# Altium project iMX6 Rex Development Baseboard V1I1.PrjPcb (part 1 of 2)
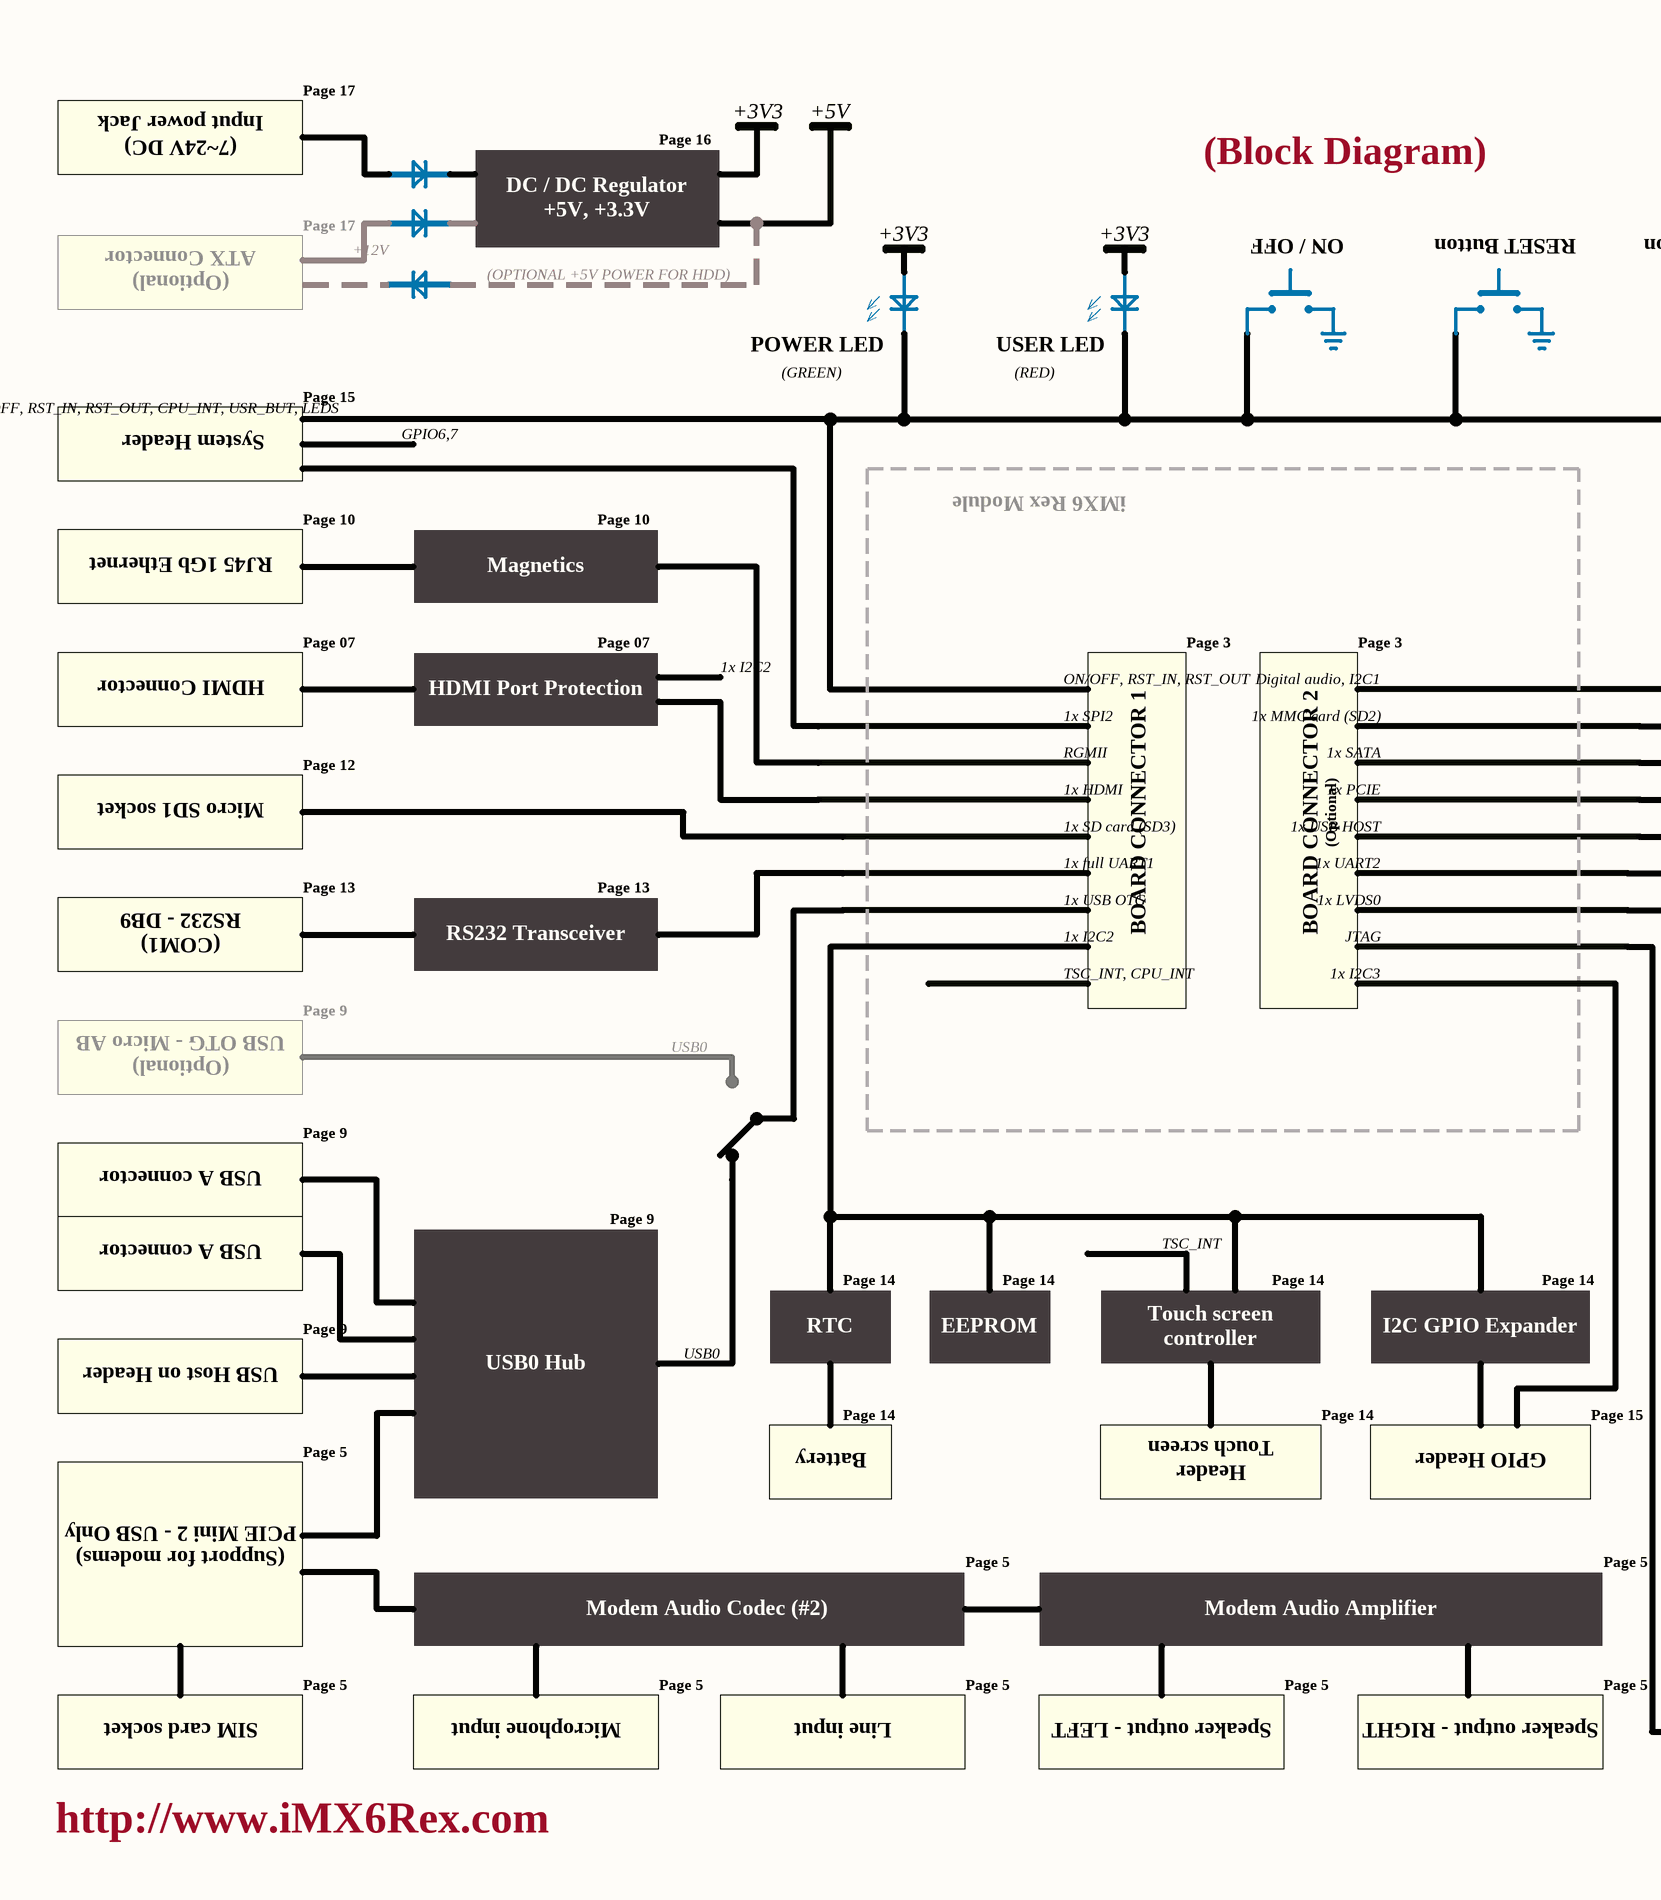
[diagram p0: [02] - BLOCK DIAGRAM.SchDoc, left]
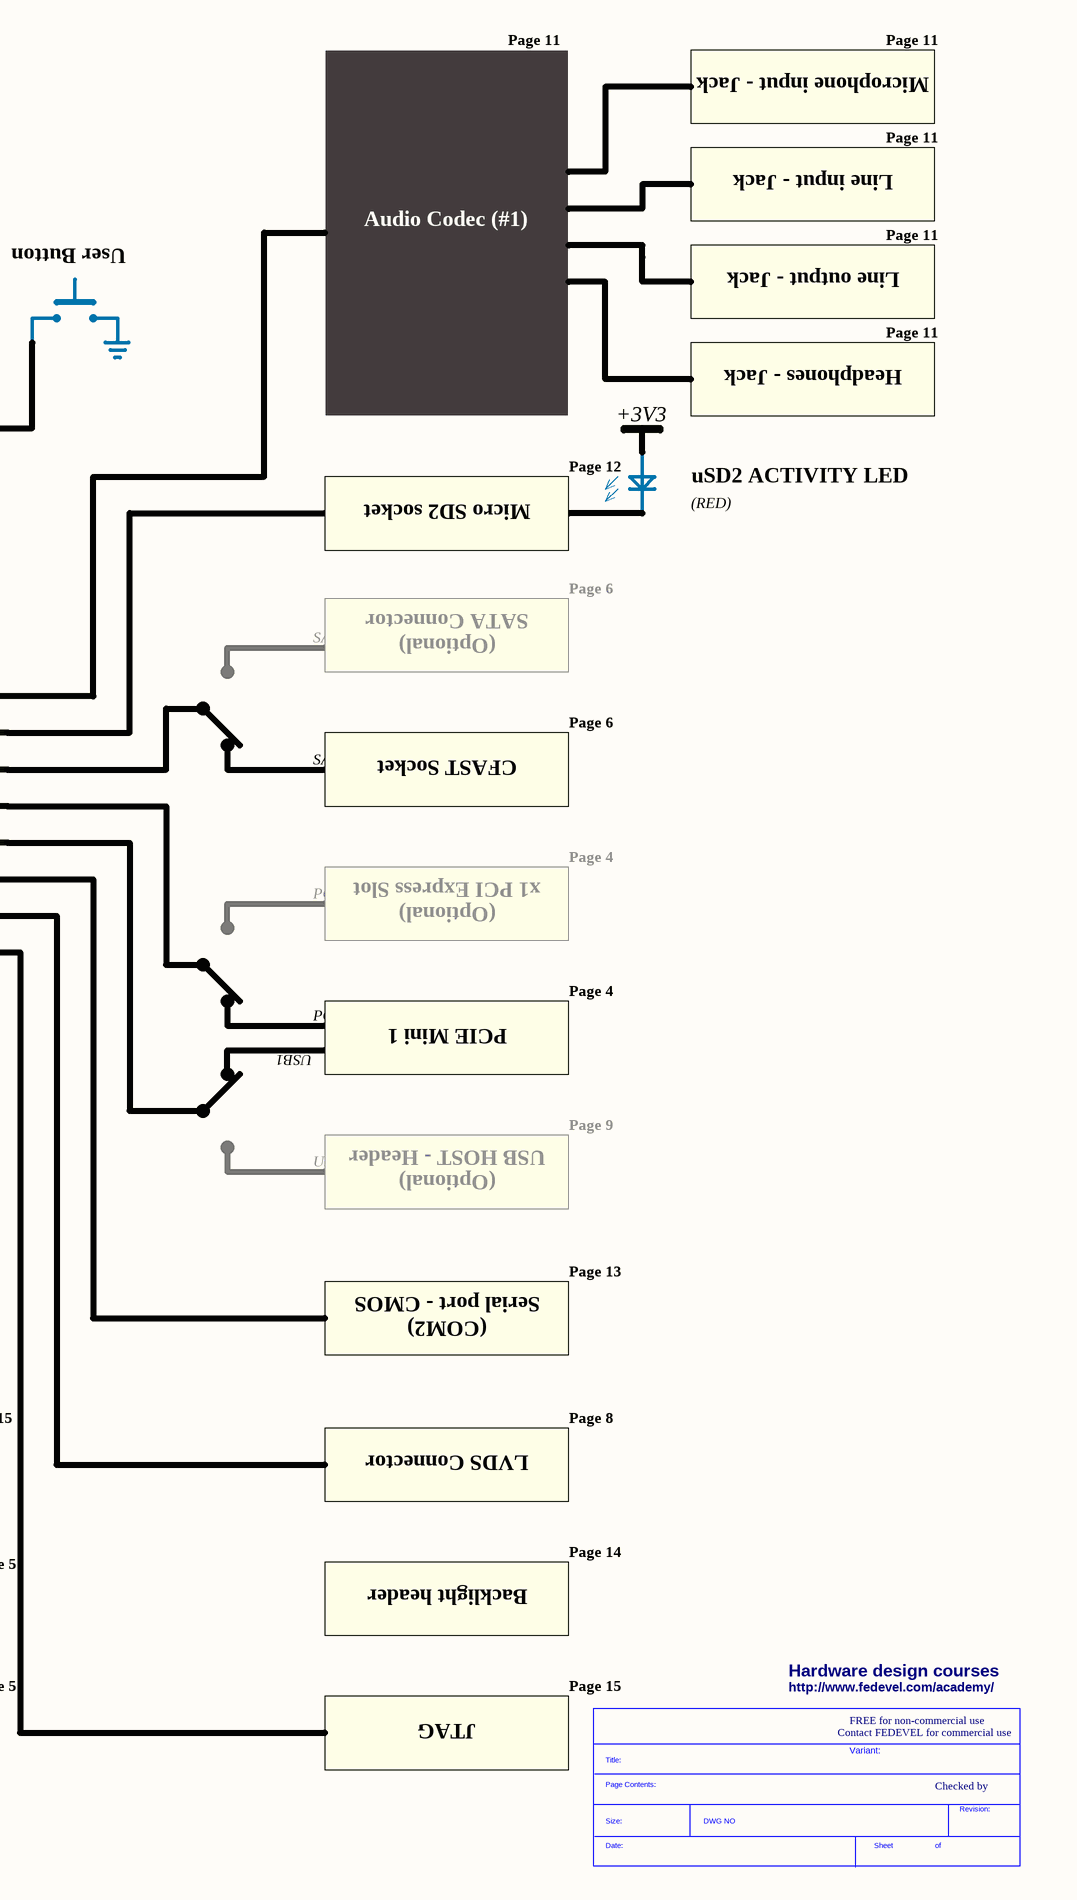
[diagram p1: [02] - BLOCK DIAGRAM.SchDoc, right]
ClientCompanyName: FEDEVEL Academy; ClientContactEmail: robert.feranec@fedevel.com; ClientContactName: Robert Feranec; ClientWebsite: http://www.fedevel.com/academy/; Company: (c) 2013 FEDEVEL www.fedevel.com; Project: iMX6 Rex Development Baseboard; VersionRevision: V1I1
4 sheets, 154 parts. Net scope: flat (ports and power ports of the same name join across sheets).
Board file: iMX6 Rex Development Baseboard V1I1_PCB.PcbDoc
Sheets:
  [02] - BLOCK DIAGRAM.SchDoc
  [05] - PCIE MINI 2, AUDIO2.SchDoc
  [08] - LVDS.SchDoc
  [13] - UARTS.SchDoc

## Sheet [02] - BLOCK DIAGRAM.SchDoc
size A2; DocumentNumber: 2; SheetNumber: 2; SheetTotal: 20; PageSetup: Record=PageOptions|CenterHorizontal=True|CenterVertical=True|PrintScale=0.73|XCorrection=1.00|YCorrection=1.00|PrintKind=0|BorderSize=5000000|LeftOffset=0|BottomOffset=0|Orientation=2|PaperLength=1000|PaperWidth=1000|Scale=100|PaperSource=7|PrintQuality=-4|MediaType=1|DitherType=10|PaperKind=A3|PrintScaleMode=1

### Parts
(Parts that share a designator on the sheet are numbered #1, #2 ... from top to bottom, then left to right.)
*#1  SDTitleBlock  (value not drawn)  (graphical)

### Notes on the sheet
- Page 11
- Microphone input - Jack
- Input power Jack
- Page 17
- Page 16
- +3V3
- +5V
- (7~24V DC)
- DC / DC Regulator
- (Block Diagram)
- Line input - Jack
- ATX Connector
- +12V
- +5V, +3.3V
- ON / OFF
- RESET Button
- User Button
- Audio Codec (#1)
- (Optional)
- (OPTIONAL +5V POWER FOR HDD)
- Line output - Jack
- (GREEN)
- POWER LED
- (RED)
- USER LED
- Headphones - Jack
- System Header
- Page 15
- ON/OFF, RST_IN, RST_OUT, CPU_INT, USR_BUT, LEDS
- GPIO6,7
- iMX6 Rex Module
- Micro SD2 socket
- Page 12
- uSD2 ACTIVITY LED
- RJ45 1Gb Ethernet
- Page 10
- Magnetics
- SATA
- SATA Connector
- Page 6
- HDMI Connector
- Page 07
- HDMI Port Protection
- 1x I2C2
- ON/OFF, RST_IN, RST_OUT
- Page 3
- Digital audio, I2C1
- RGMII
- 1x SPI2
- 1x SATA
- 1x MMC card (SD2)
- Micro SD1 socket
- 1x HDMI
- BOARD CONNECTOR 1
- BOARD CONNECTOR 2
- 1x PCIE
- CFAST Socket
- 1x SD card (SD3)
- 1x full UART1
- 1x USB HOST
- 1x UART2
- Page 4
- RS232 - DB9
- Page 13
- RS232 Transceiver
- 1x USB OTG
- JTAG
- 1x LVDS0
- PCIE
- x1 PCI Express Slot
- (COM1)
- TSC_INT, CPU_INT
- 1x I2C3
- USB OTG - Micro AB
- Page 9
- USB0
- USB1
- PCIE Mini 1
- USB A connector
- USB HOST - Header
- TSC_INT
- Page 14
- Serial port - CMOS
- USB0 Hub
- RTC
- EEPROM
- Touch screen
- controller
- I2C GPIO Expander
- (COM2)
- USB Host on Header
- Page 8
- Page 5
- Battery
- Header
- GPIO Header
- LVDS Connector
- PCIE Mini 2 - USB Only
- (Support for modems)
- Modem Audio Codec (#2)
- Modem Audio Amplifier
- Backlight header
- Hardware design courses
- SIM card socket
- Microphone input
- Line input
- Speaker output - LEFT
- Speaker output - RIGHT
- (near *#1) Page 15
- http://www.fedevel.com/academy/
- Contact FEDEVEL for commercial use
- FREE for non-commercial use
- Variant:
- Checked by
- http://www.iMX6Rex.com
- (in symbol SDTitleBlock) Title:; Page Contents:; Revision:; Size:; DWG NO; Date:; Sheet; of

## Sheet [05] - PCIE MINI 2, AUDIO2.SchDoc
size A2; DocumentNumber: 2; SheetNumber: 5; SheetTotal: 20
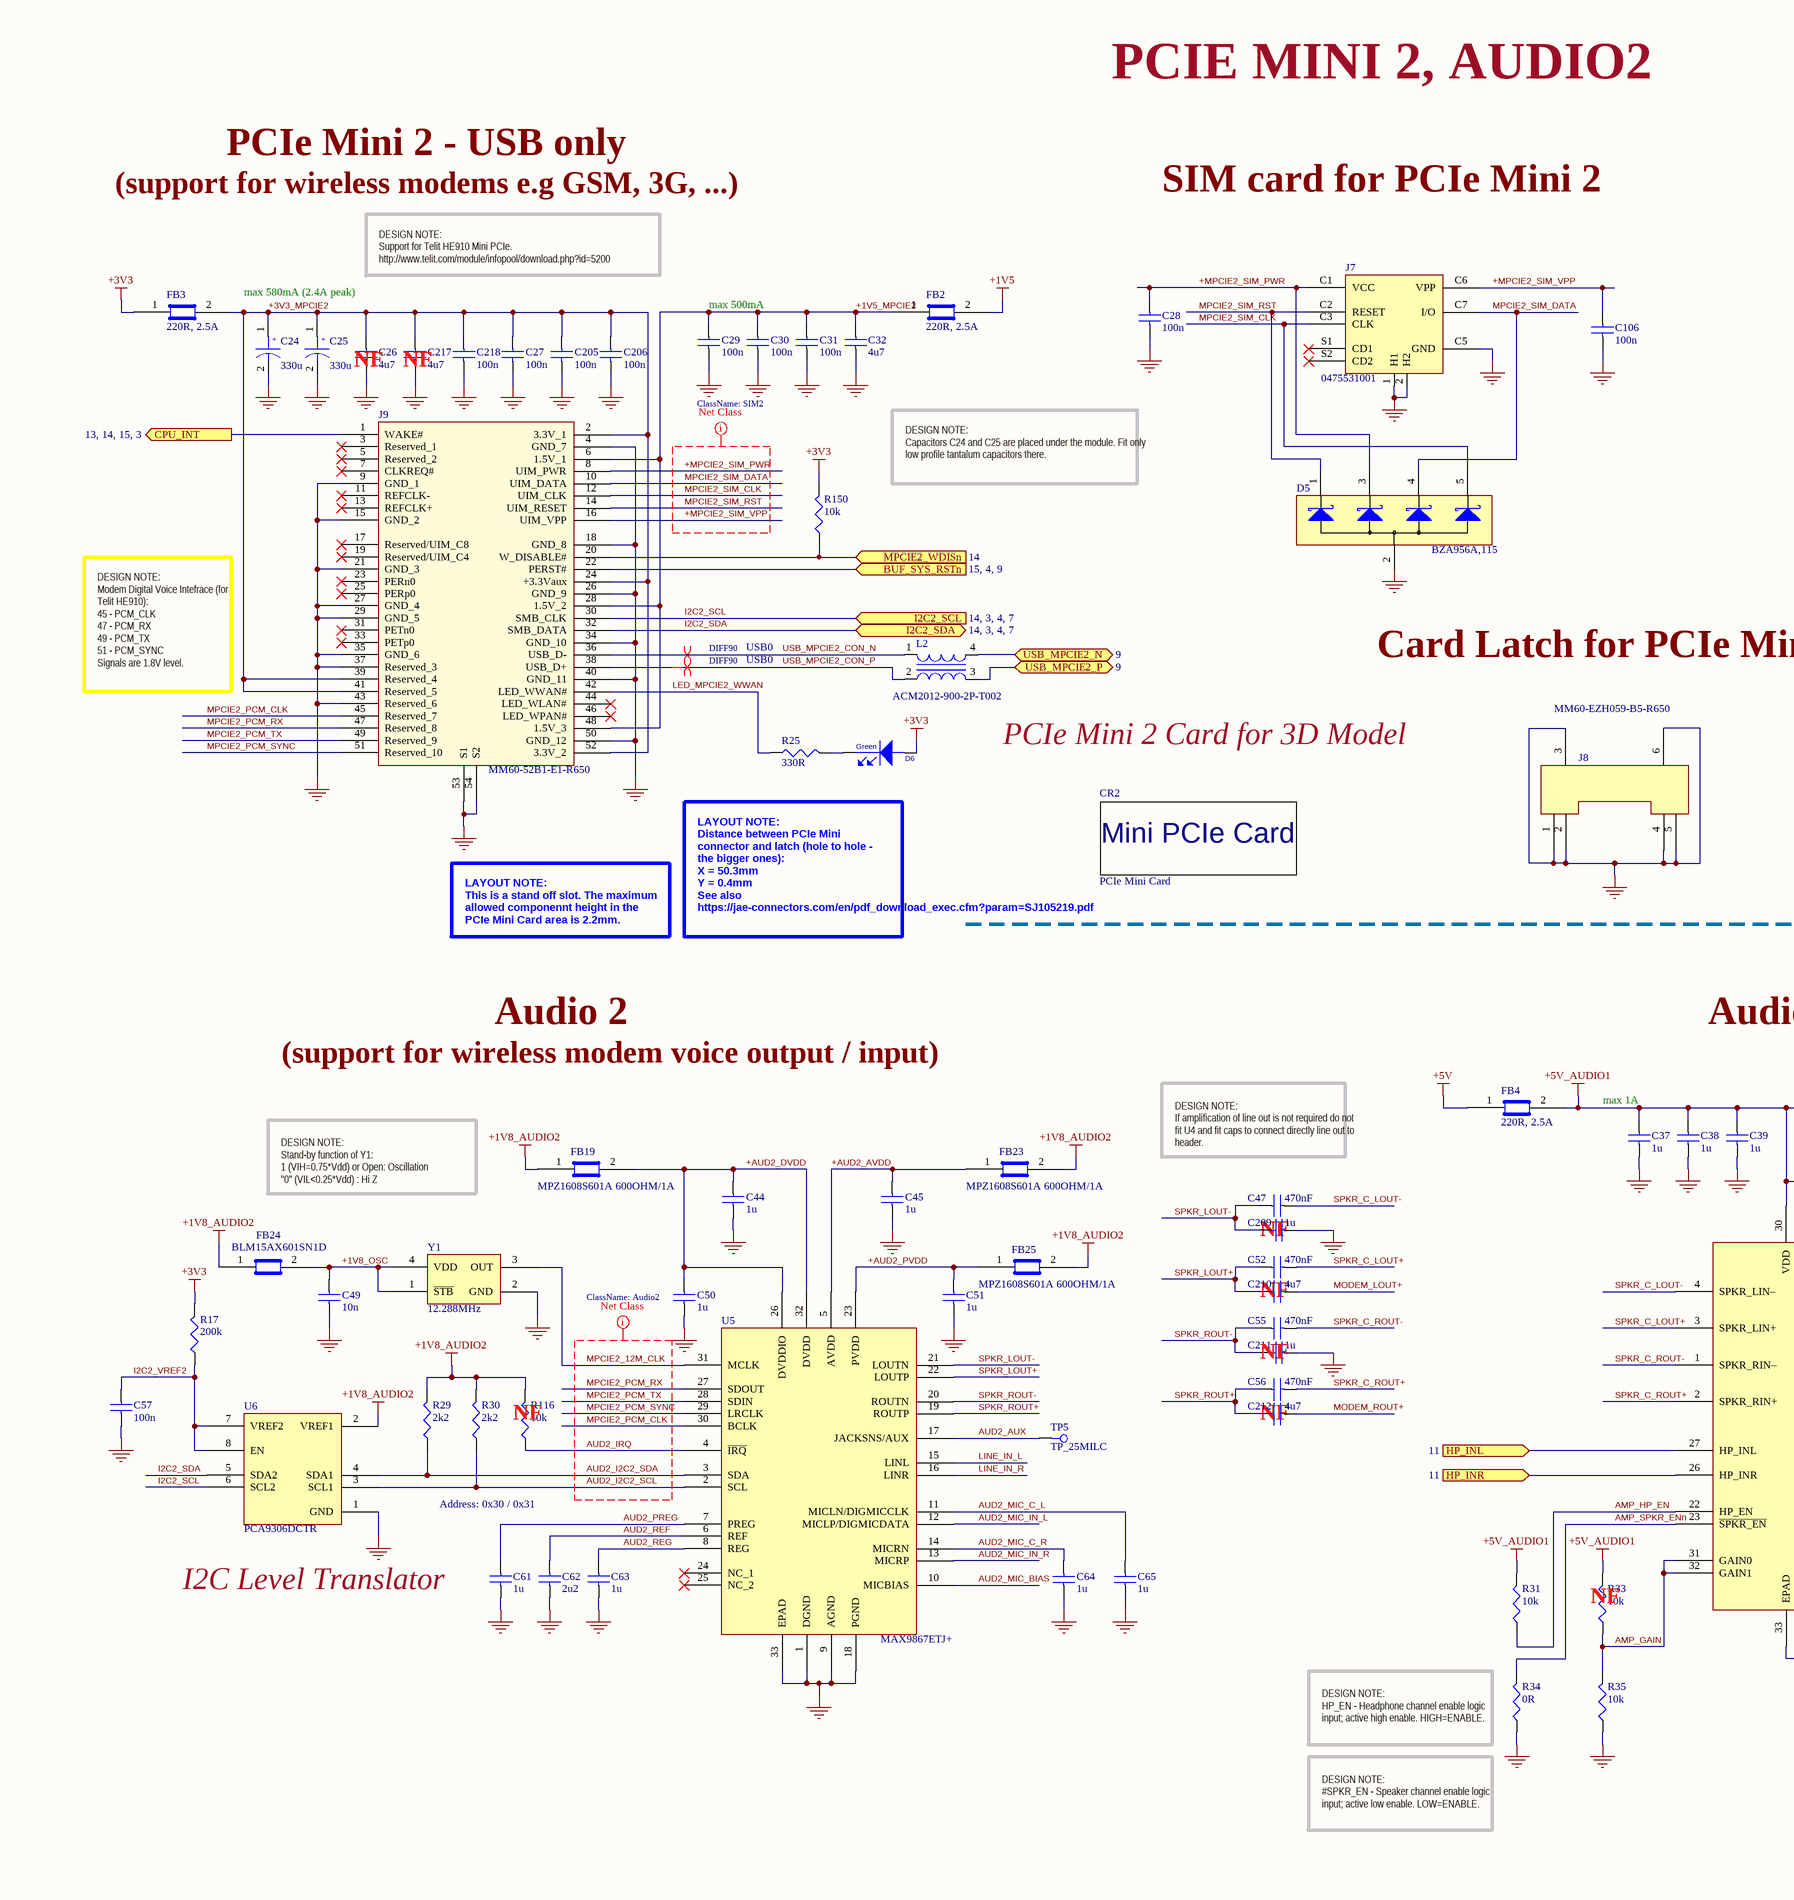
[diagram p2: [05] - PCIE MINI 2, AUDIO2.SchDoc, left]
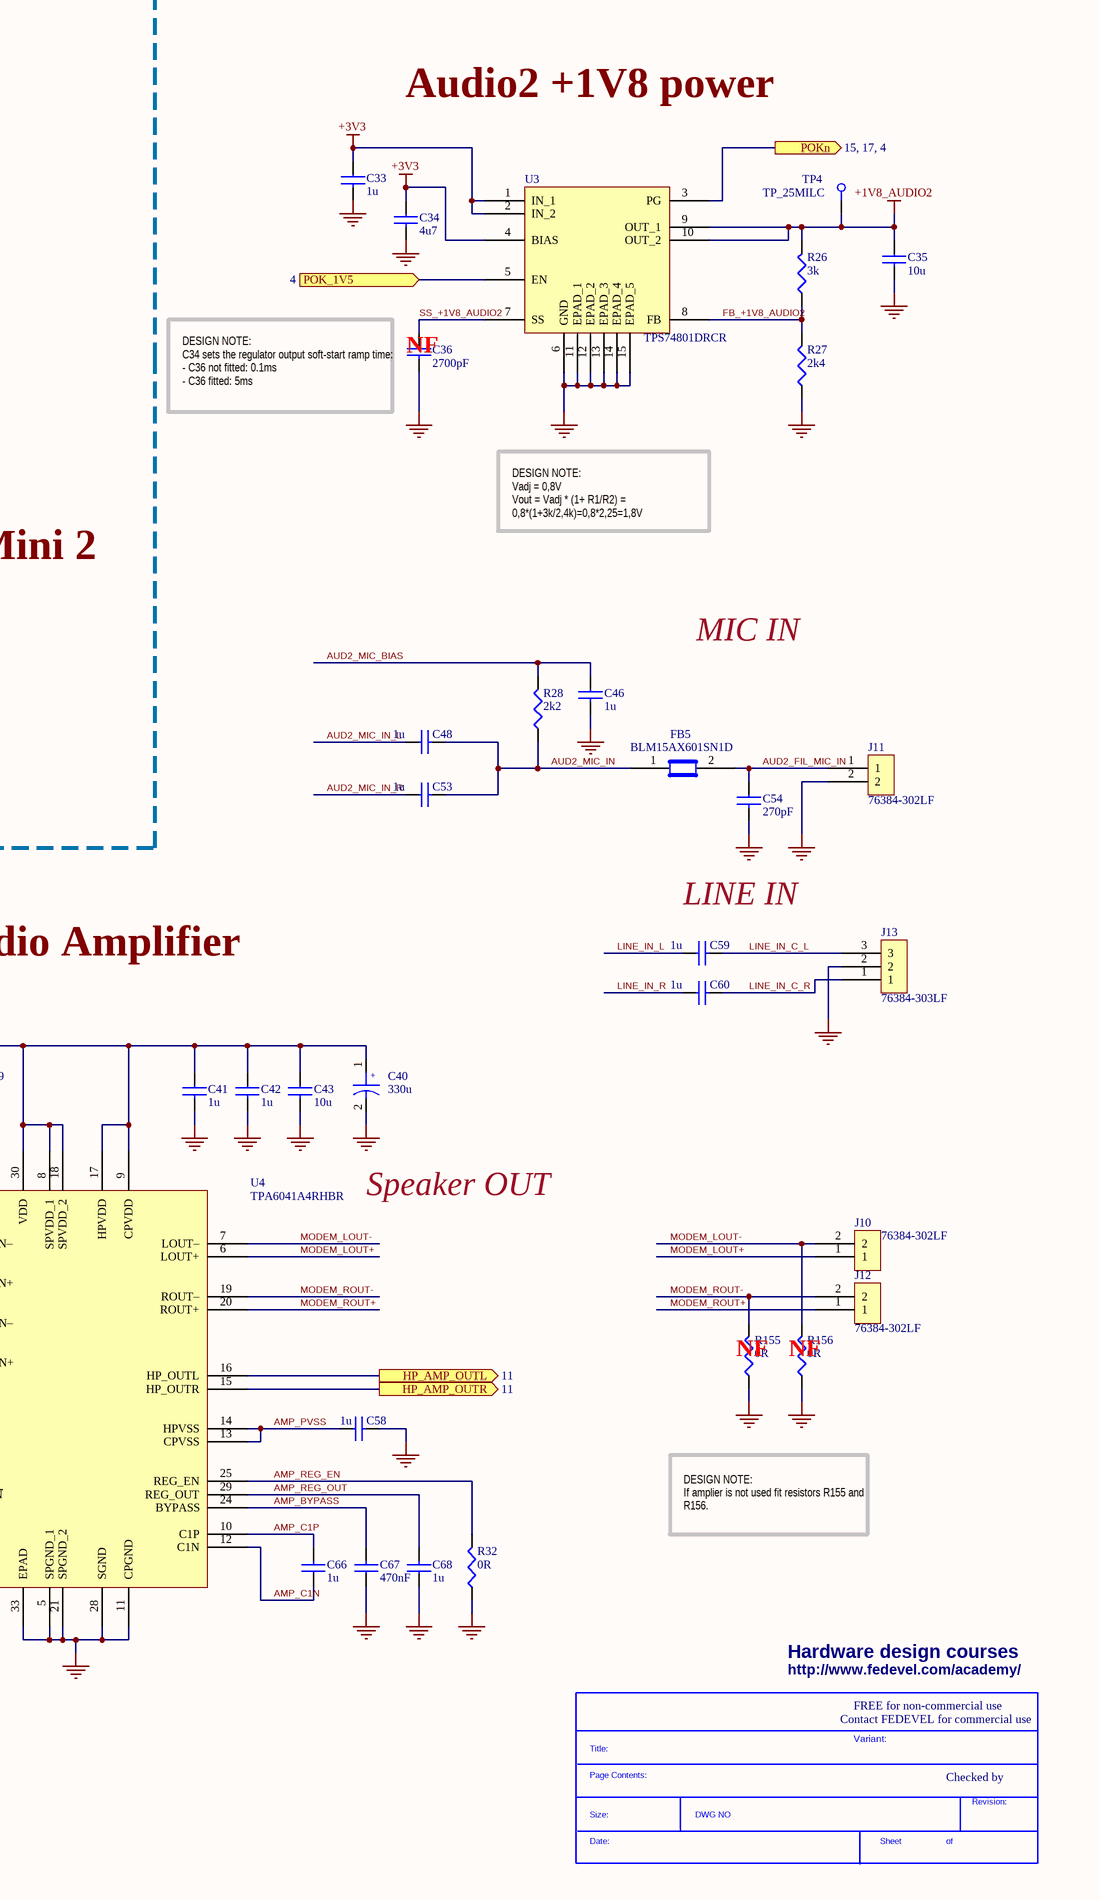
[diagram p3: [05] - PCIE MINI 2, AUDIO2.SchDoc, right]

### Parts
(Parts that share a designator on the sheet are numbered #1, #2 ... from top to bottom, then left to right.)
*#2  SDTitleBlock  (value not drawn)  (graphical)
C24  330u  [C2917]
C25  330u  [C2917]
C26  4u7  [C0402]
C27  100n  [C0402]
C28  100n  [C0402]
C29  100n  [C0402]
C30  100n  [C0402]
C31  100n  [C0402]
C32  4u7  [C0402]
C33  1u  [C0402]
C34  4u7  [C0402]
C35  10u  [C0603]
C36  2700pF  [C0402]
C37  1u  [C0402]
C38  1u  [C0402]
C39  1u  [C0402]
C40  330u  [C2917]
C41  1u  [C0402]
C42  1u  [C0402]
C43  10u  [C0603]
C44  1u  [C0402]
C45  1u  [C0402]
C46  1u  [C0402]
C47  470nF  [C0402]
C48  1u  [C0402]
C49  10n  [C0402]
C50  1u  [C0402]
C51  1u  [C0402]
C52  470nF  [C0402]
C53  1u  [C0402]
C54  270pF  [C0402]
C55  470nF  [C0402]
C56  470nF  [C0402]
C57  100n  [C0402]
C58  1u  [C0402]
C59  1u  [C0402]
C60  1u  [C0402]
C61  1u  [C0402]
C62  2u2  [C0402]
C63  1u  [C0402]
C64  1u  [C0402]
C65  1u  [C0402]
C66  1u  [C0402]
C67  470nF  [C0402]
C68  1u  [C0402]
C106  100n  [C0402]
C205  100n  [C0402]
C206  100n  [C0402]
C209  1u  [C0402]
C210  4u7  [C0402]
C211  1u  [C0402]
C212  4u7  [C0402]
C217  4u7  [C0402]
C218  100n  [C0402]
CR2  PCIe Mini Card  [Mini_PCIe_full card]  (no BOM)
D5  BZA956A,115  [SOT665]
D6  Green  [LED_0603]
FB2  220R, 2.5A  [C0603]
FB3  220R, 2.5A  [C0603]
FB4  220R, 2.5A  [C0603]
FB5  BLM15AX601SN1D  [C0402]
FB19  MPZ1608S601A 600OHM/1A  [C0603]
FB23  MPZ1608S601A 600OHM/1A  [C0603]
FB24  BLM15AX601SN1D  [C0402]
FB25  MPZ1608S601A 600OHM/1A  [C0603]
J7  0475531001  [SIM_CARD_PUSH]
J8  MM60-EZH059-B5-R650  [MINI_PCIE_52PIN_CARD_LATCH]
J9  MM60-52B1-E1-R650  [MINI_PCIE_52PIN_CARD_CON]
J10  76384-302LF  [HDR_1x2_2.54MM_SHDR]
J11  76384-302LF  [HDR_1x2_2.54MM_SHDR]
J12  76384-302LF  [HDR_1x2_2.54MM_SHDR]
J13  76384-303LF  [HDR_1x3_2.54MM_SHDR_V2]
L2  ACM2012-900-2P-T002  [ACM2012]
R17  200k  [R0402]
R25  330R  [R0402]
R26  3k  [R0402]
R27  2k4  [R0402]
R28  2k2  [R0402]
R29  2k2  [R0402]
R30  2k2  [R0402]
R31  10k  [R0402]
R32  0R  [R0402]
R33  10k  [R0402]
R34  0R  [R0402]
R35  10k  [R0402]
R116  10k  [R0402]
R150  10k  [R0402]
R155  0R  [R0402]
R156  0R  [R0402]
TP4  TP_25MILC  [TP_25C]  (no BOM)
TP5  TP_25MILC  [TP_25C]  (no BOM)
U3  TPS74801DRCR  [DRC (S-PVSON-N10)]
U4  TPA6041A4RHBR  [VQFN32 5x5x0.85]
U5  MAX9867ETJ+  [QFN32 5x5x0.85]
U6  PCA9306DCTR  [DCT_8]
Y1  12.288MHz  [ASFLMB]

### Ports
BUF_SYS_RSTn (see 15, 4, 9), CPU_INT (out, see 13, 14, 15, 3), HP_AMP_OUTL (out, see 11), HP_AMP_OUTR (out, see 11), HP_INL (in, see 11), HP_INR (in, see 11), I2C2_SCL (see 14, 3, 4, 7), I2C2_SDA (bidir, see 14, 3, 4, 7), MPCIE2_WDISn (in, see 14), POK_1V5 (in, see 4), POKn (see 15, 17, 4), USB_MPCIE2_N (bidir, see 9), USB_MPCIE2_P (bidir, see 9)

### Nets
+1V5: FB2.2
+1V8_AUDIO2: C35.1 FB19.1 FB23.2 FB24.1 FB25.2 R26.2 R29.2 R30.2 R116.2 TP4.1 U3.9(OUT_1) U3.10(OUT_2) U6.2(VREF1)
+3V3: C33.1 C34.1 D6.2(ANODE) FB3.1 R17.2 R150.2 U3.1(IN_1) U3.2(IN_2) U3.4(BIAS)
+5V: FB4.1
+5V_AUDIO1: C37.1 C38.1 C39.1 C40.1 C41.1 C42.1 C43.1 FB4.2 R31.2 R33.2 U4.8(SPVDD_1) U4.9(CPVDD) U4.17(HPVDD) U4.18(SPVDD_2) U4.30(VDD)
GND: C24.2 C25.2 C26.2 C27.2 C28.2 C29.2 C30.2 C31.2 C32.2 C33.2 C34.2 C35.2 C36.2 C37.2 C38.2 C39.2 C40.2 C41.2 C42.2 C43.2 C44.2 C45.2 C46.2 C49.2 C50.2 C51.2 C54.2 C57.2 C58.2 C61.2 C62.2 C63.2 C64.1 C65.1 C67.1 C68.1 C106.2 C205.2 C206.2 C209.1 C211.1 C217.2 C218.2 D5.2 J7.1(H1) J7.2(H2) J7.C5(GND) J8.1 J8.2 J8.3 J8.4 J8.5 J8.6 J9.4(GND_7) J9.9(GND_1) J9.15(GND_2) J9.18(GND_8) J9.21(GND_3) J9.26(GND_9) J9.27(GND_4) J9.29(GND_5) J9.34(GND_10) J9.35(GND_6) J9.37(Reserved_3) J9.40(GND_11) J9.43(Reserved_6) J9.50(GND_12) J9.53(S1) J9.54(S2) J11.2 J13.2 R27.1 R32.1 R34.1 R35.1 R155.1 R156.1 U3.6(GND) U3.11(EPAD_1) U3.12(EPAD_2) U3.13(EPAD_3) U3.14(EPAD_4) U3.15(EPAD_5) U4.5(SPGND_1) U4.11(CPGND) U4.21(SPGND_2) U4.28(SGND) U4.33(EPAD) U5.1(DGND) U5.9(AGND) U5.18(PGND) U5.33(EPAD) U6.1(GND) Y1.2(GND)
+1V5_MPCIE2: C29.1 C30.1 C31.1 C32.1 FB2.1 J9.6(1.5V_1) J9.28(1.5V_2) J9.48(1.5V_3)
+1V8_OSC: C49.1 FB24.2 Y1.1(~{STB}) Y1.4(VDD)
+3V3_MPCIE2: C24.1 C25.1 C26.1 C27.1 C205.1 C206.1 C217.1 C218.1 FB3.2 J9.2(3.3V_1) J9.24(+3.3Vaux) J9.39(Reserved_4) J9.41(Reserved_5) J9.52(3.3V_2)
+AUD2_AVDD: C45.1 FB23.1 U5.5(AVDD)
+AUD2_DVDD: C44.1 C50.1 FB19.2 U5.26(DVDDIO) U5.32(DVDD)
+AUD2_PVDD: C51.1 FB25.1 U5.23(PVDD)
+MPCIE2_SIM_PWR: C28.1 D5.3 J7.C1(VCC) J9.8(UIM_PWR)
+MPCIE2_SIM_VPP: C106.1 J7.C6(VPP) J9.16(UIM_VPP)
AMP_BYPASS: C67.2 U4.24(BYPASS)
AMP_C1N: C66.1 U4.12(C1N)
AMP_C1P: C66.2 U4.10(C1P)
AMP_GAIN: R33.1 R35.2 U4.31(GAIN0) U4.32(GAIN1)
AMP_HP_EN: R31.1 U4.22(HP_EN)
AMP_PVSS: C58.1 U4.13(CPVSS) U4.14(HPVSS)
AMP_REG_EN: R32.2 U4.25(REG_EN)
AMP_REG_OUT: C68.2 U4.29(REG_OUT)
AMP_SPKR_ENn: R34.2 U4.23(~{SPKR_EN})
AUD2_AUX: TP5.1 U5.17(JACKSNS/AUX)
AUD2_FIL_MIC_IN: C54.1 FB5.2 J11.1
AUD2_I2C2_SCL: R30.1 U5.2(SCL) U6.3(SCL1)
AUD2_I2C2_SDA: R29.1 U5.3(SDA) U6.4(SDA1)
AUD2_IRQ: R116.1 U5.4(~{IRQ})
AUD2_MIC_BIAS: C46.1 R28.2 U5.10(MICBIAS)
AUD2_MIC_C_L: C65.2 U5.11(MICLN/DIGMICCLK)
AUD2_MIC_C_R: C64.2 U5.14(MICRN)
AUD2_MIC_IN: C48.2 C53.2 FB5.1 R28.1
AUD2_MIC_IN_L: C48.1 U5.12(MICLP/DIGMICDATA)
AUD2_MIC_IN_R: C53.1 U5.13(MICRP)
AUD2_PREG: C61.1 U5.7(PREG)
AUD2_REF: C62.1 U5.6(REF)
AUD2_REG: C63.1 U5.8(REG)
BUF_SYS_RSTn: J9.22(PERST#) ; port BUF_SYS_RSTn
CPU_INT: J9.1(WAKE#) ; port CPU_INT
FB_+1V8_AUDIO2: R26.1 R27.2 U3.8(FB)
HP_AMP_OUTL: U4.16(HP_OUTL) ; port HP_AMP_OUTL
HP_AMP_OUTR: U4.15(HP_OUTR) ; port HP_AMP_OUTR
HP_INL: U4.27(HP_INL) ; port HP_INL
HP_INR: U4.26(HP_INR) ; port HP_INR
I2C2_SCL: J9.30(SMB_CLK) U6.6(SCL2) ; port I2C2_SCL
I2C2_SDA: J9.32(SMB_DATA) U6.5(SDA2) ; port I2C2_SDA
I2C2_VREF2: C57.1 R17.1 U6.7(VREF2) U6.8(EN)
LED_MPCIE2_WWAN: J9.42(LED_WWAN#) R25.1
LINE_IN_C_L: C59.2 J13.3
LINE_IN_C_R: C60.2 J13.1
LINE_IN_L: C59.1 U5.15(LINL)
LINE_IN_R: C60.1 U5.16(LINR)
MODEM_LOUT+: C210.2 J10.1 U4.6(LOUT+)
MODEM_LOUT-: J10.2 R156.2 U4.7(LOUT–)
MODEM_ROUT+: C212.2 J12.1 U4.20(ROUT+)
MODEM_ROUT-: J12.2 R155.2 U4.19(ROUT–)
MPCIE2_12M_CLK: U5.31(MCLK) Y1.3(OUT)
MPCIE2_PCM_CLK: J9.45(Reserved_7) U5.30(BCLK)
MPCIE2_PCM_RX: J9.47(Reserved_8) U5.27(SDOUT)
MPCIE2_PCM_SYNC: J9.51(Reserved_10) U5.29(LRCLK)
MPCIE2_PCM_TX: J9.49(Reserved_9) U5.28(SDIN)
MPCIE2_SIM_CLK: D5.5 J7.C3(CLK) J9.12(UIM_CLK)
MPCIE2_SIM_DATA: D5.4 J7.C7(I/O) J9.10(UIM_DATA)
MPCIE2_SIM_RST: D5.1 J7.C2(RESET) J9.14(UIM_RESET)
MPCIE2_WDISn: J9.20(W_DISABLE#) R150.1 ; port MPCIE2_WDISn
POK_1V5: U3.5(EN) ; port POK_1V5
POKn: U3.3(PG) ; port POKn
SPKR_C_LOUT+: C52.2 U4.3(SPKR_LIN+)
SPKR_C_LOUT-: C47.2 U4.4(SPKR_LIN–)
SPKR_C_ROUT+: C56.2 U4.2(SPKR_RIN+)
SPKR_C_ROUT-: C55.2 U4.1(SPKR_RIN–)
SPKR_LOUT+: C52.1 C210.1 U5.22(LOUTP)
SPKR_LOUT-: C47.1 C209.2 U5.21(LOUTN)
SPKR_ROUT+: C56.1 C212.1 U5.19(ROUTP)
SPKR_ROUT-: C55.1 C211.2 U5.20(ROUTN)
SS_+1V8_AUDIO2: C36.1 U3.7(SS)
USB_MPCIE2_CON_N: J9.36(USB_D-) L2.1
USB_MPCIE2_CON_P: J9.38(USB_D+) L2.2
USB_MPCIE2_N: L2.4 ; port USB_MPCIE2_N
USB_MPCIE2_P: L2.3 ; port USB_MPCIE2_P
NetD6_1: D6.1(cathode) R25.2

Not connected (* = marked no-connect by the designer): J7 S1(CD1)* S2(CD2)*; J9 3(Reserved_1)* 5(Reserved_2)* 7(CLKREQ#)* 11(REFCLK-)* 13(REFCLK+)* 17(Reserved/UIM_C8)* 19(Reserved/UIM_C4)* 23(PERn0)* 25(PERp0)* 31(PETn0)* 33(PETp0)* 44(LED_WLAN#)* 46(LED_WPAN#)*; U5 24(NC_1)* 25(NC_2)*

### Layout directives
differential pair; net class DIFF90; net class USB0: USB_MPCIE2_CON_N, USB_MPCIE2_CON_P
net class SIM2: +MPCIE2_SIM_PWR, +MPCIE2_SIM_VPP, MPCIE2_SIM_CLK, MPCIE2_SIM_DATA, MPCIE2_SIM_RST
net class Audio2: AUD2_I2C2_SCL, AUD2_I2C2_SDA, AUD2_IRQ, MPCIE2_12M_CLK, MPCIE2_PCM_CLK, MPCIE2_PCM_RX, MPCIE2_PCM_SYNC, MPCIE2_PCM_TX

### Notes on the sheet
- PCIE MINI 2, AUDIO2
- PCIe Mini 2 - USB only
- (support for wireless modems e.g GSM, 3G, ...)
- SIM card for PCIe Mini 2
- Audio2 +1V8 power
- max 580mA (2.4A peak)
- DESIGN NOTE:
  Support for Telit HE910 Mini PCIe. http://www.telit.com/module/infopool/download.php?id=5200
- max 500mA
- (near C26) NF
- (near C217) NF
- DESIGN NOTE:
  Capacitors C24 and C25 are placed under the module. Fit only low profile tantalum capacitors there.
- (near C36) DESIGN NOTE:
  C34 sets the regulator output soft-start ramp time:
  - C36 not fitted: 0.1ms
  - C36 fitted: 5ms
- (near C36) NF
- DESIGN NOTE:
  Vadj = 0,8V
  Vout = Vadj * (1+ R1/R2) = 0,8*(1+3k/2,4k)=0,8*2,25=1,8V
- DESIGN NOTE:
  Modem Digital Voice Intefrace (for Telit HE910):
  45 - PCM_CLK
  47 - PCM_RX
  49 - PCM_TX
  51 - PCM_SYNC
  Signals are 1.8V level.
- Card Latch for PCIe Mini 2
- PCIe Mini 2 Card for 3D Model
- MIC IN
- LAYOUT NOTE:
  This is a stand off slot. The maximum allowed componennt height in the PCIe Mini Card area is 2.2mm.
- LAYOUT NOTE:
  Distance between PCIe Mini connector and latch (hole to hole - the bigger ones):
  X = 50.3mm
  Y = 0.4mm
  See also https://jae-connectors.com/en/pdf_download_exec.cfm?param=SJ105219.pdf
- (near C59) LINE IN
- Audio 2
- (support for wireless modem voice output / input)
- Audio Amplifier
- (near C37) max 1A
- DESIGN NOTE:
  Stand-by function of Y1:
  1 (VIH=0.75*Vdd) or Open: Oscillation
  "0" (VIL<0.25*Vdd) : Hi Z
- DESIGN NOTE:
  If amplification of line out is not required do not fit U4 and fit caps to connect directly line out to header.
- (near C209) NF
- Speaker OUT
- (near C210) NF
- (near C211) NF
- (near R116) NF
- (near C212) NF
- (near R155) NF
- (near R156) NF
- Address: 0x30 / 0x31
- DESIGN NOTE:
  If amplier is not used fit resistors R155 and R156.
- (near C61) I2C Level Translator
- (near R33) NF
- Hardware design courses
- (near R34) DESIGN NOTE:
  HP_EN - Headphone channel enable logic input; active high enable. HIGH=ENABLE.
- http://www.fedevel.com/academy/
- Contact FEDEVEL for commercial use
- FREE for non-commercial use
- Variant:
- Checked by
- DESIGN NOTE:
  #SPKR_EN - Speaker channel enable logic input; active low enable. LOW=ENABLE.
- (in symbol Card_Mini_PCIe) Mini PCIe Card
- (in symbol SDTitleBlock) Title:; Page Contents:; Revision:; Size:; DWG NO; Date:; Sheet; of
- (in symbol T495D337K010ATE150) +
- (in symbol T520D337M006ATE045) +

### Library data of the parts
C24 C25 = T520D337M006ATE045: CAP TANT 330UF 6.3V 20% 2917; Manufacturer: Kemet; Manufacturer Size Code: D; Capacitance: 330µF; ESR (Equivalent Series Resistance): 45 mOhm; Type: Molded; .Creator: MM; .Checked SCH: RF, used by MM; Supplier 1: Digi-Key; Manufacturer Part Number: T520D337M006ATE045; RoHS: RoHS Compliant; Category: Capacitors; Stock 1: 11758; Pricing 1: 1=1.33, 10=1.05, 50=0.91, 100=0.7875, 250=0.7 (USD); Packaging: Cut Tape (CT); Voltage - Rated: 6.3V; Tolerance: ±20%; Operating Temperature: -55°C ~ 105°C; Mounting Type: Surface Mount; Package / Case: 2917 (7343 Metric); Size / Dimension: 0.287" L x 0.169" W (7.30mm x 4.30mm); Height - Seated (Max): 0.122" (3.10mm); Lead Spacing: -; Features: Polymer; Lifetime @ Temp.: -; ComponentLink1URL: http://www.kemet.com/kemet/web/homepage/kechome.nsf/file/T520%20Series/$file/KEM_T2015_T520.pdf; ComponentLink1Description: http://www.kemet.com/kemet/web/homepage/kechome.nsf/file/T520%20Series/$file/KEM_T2015_T520.pdf; Supplier Part Number 1: 399-4055-1-ND; .Checked PCB: MM
C26 C32 C34 C210 C212 C217 = C1005X5R1A475M: CAP CER 4.7UF 10V 20% X5R 0402; Manufacturer: TDK Corporation; Capacitance: 4.7µF; .Checked PCB: RF; Supplier 1: Digi-Key; Supplier Part Number 1: 445-8023-1-ND; Manufacturer Part Number: C1005X5R1A475M; RoHS: RoHS Compliant; Category: Capacitors; Stock 1: 10140; Pricing 1: 1=0.53, 10=0.415, 100=0.25, 250=0.18752, 500=0.16, 1000=0.125, 5000=0.095 (USD); Voltage - Rated: 10V; Tolerance: ±20%; Temperature Coefficient: X5R; Mounting Type: Surface Mount, MLCC; Operating Temperature: -55°C ~ 85°C; Applications: General Purpose; Ratings: -; Package / Case: 0402 (1005 Metric); Size / Dimension: 0.039" L x 0.020" W (1.00mm x 0.50mm); Height - Seated (Max): -; Thickness (Max): -; Lead Spacing: -; Features: -; Packaging: Cut Tape (CT); Lead Style: -; ComponentLink1URL: http://www.tdk.com/pdf/general_B11.pdf; ComponentLink1Description: http://www.tdk.com/pdf/general_B11.pdf; .Checked SCH: RF
C27-C31 C57 C106 C205 C206 C218 = C1005X5R1H104K: CAP CER .10UF 50V X5R 10% 0402; Manufacturer: TDK Corporation; Capacitance: 0.1µF; Value: 100nF; .Checked PCB: used; Description: CAP CER 0.1UF 50V 10% X5R 0402; Category: Capacitors; Supplier Part Number: 445-5942-1-ND; Manufacturer Part Number: C1005X5R1H104K; Operating Temperature: -55°C ~ 85°C; Package / Case: 0402 (1005 Metric); Price 1k [$]: 0.02340; .Checked SCH: used; Voltage - Rated: 50V; Supplier: Digikey; Supplier 1: Digi-Key; Supplier Part Number 1: 445-5942-1-ND; RoHS: RoHS Compliant; Stock 1: 106926; Pricing 1: 1=0.27, 10=0.18, 100=0.072, 250=0.05176, 500=0.0369, 1000=0.027 (USD); Tolerance: ±10%; Temperature Coefficient: X5R; Mounting Type: Surface Mount, MLCC; Applications: General Purpose; Ratings: -; Size / Dimension: 0.039" L x 0.020" W (1.00mm x 0.50mm); Height - Seated (Max): -; Thickness (Max): 0.022" (0.55mm); Lead Spacing: -; Features: -; Packaging: Cut Tape (CT); Lead Style: -; ComponentLink1URL: http://www.tdk.co.jp/tefe02/e412_c.pdf; ComponentLink1Description: http://www.tdk.co.jp/tefe02/e412_c.pdf
C33 C37-C39 C41 C42 C44-C46 C48 C50 C51 C53 C58-C61 C63-C66 C68 C209 C211 = C1005X5R1C105K: CAP CER 1.0UF 16V X5R 0402; Manufacturer: TDK Corporation; Capacitance: 1.0µF; Value: 1uF; .Checked PCB: used; Description: CAP CER 1UF 16V 10% X5R 0402; Tolerance: ±10%; Category: Capacitors; Supplier Part Number: 445-4978-1-ND; Manufacturer Part Number: C1005X5R1C105K; Operating Temperature: -55°C ~ 85°C; Package / Case: 0402 (1005 Metric); Price 1k [$]: 0.02080; .Checked SCH: used; Voltage - Rated: 16V; Supplier: Digikey; Supplier 1: Digi-Key; Supplier Part Number 1: 445-4978-1-ND; RoHS: RoHS Compliant; Stock 1: 341010; Pricing 1: 1=0.24, 10=0.16, 100=0.064, 250=0.046, 500=0.0328, 1000=0.024 (USD); Temperature Coefficient: X5R; Mounting Type: Surface Mount, MLCC; Applications: General Purpose; Ratings: -; Size / Dimension: 0.039" L x 0.020" W (1.00mm x 0.50mm); Height - Seated (Max): -; Thickness (Max): 0.022" (0.55mm); Lead Spacing: -; Features: -; Packaging: Cut Tape (CT); Lead Style: -; ComponentLink1URL: http://www.tdk.co.jp/tefe02/e412_c.pdf; ComponentLink1Description: http://www.tdk.co.jp/tefe02/e412_c.pdf
C35 C43 = C1608X5R0J106M: CAP CER 10UF 6.3V X5R 20% 0603; Manufacturer: TDK Corporation; Capacitance: 10µF; Value: 10µF; .Checked PCB: used; Description: CAP CER 10UF 6.3V 20% X5R 0603; Category: Capacitors; Supplier Part Number: 445-4112-1-ND; Manufacturer Part Number: C1608X5R0J106M; Operating Temperature: -55°C ~ 85°C; Package / Case: 0603 (1608 Metric); Price 1k [$]: 0.08580; .Checked SCH: used; Voltage - Rated: 6.3V; Features: Low ESR; Supplier: Digikey; Supplier 1: Digi-Key; Supplier Part Number 1: 445-4112-1-ND; RoHS: RoHS Compliant; Stock 1: 48157; Pricing 1: 1=0.46, 10=0.363, 100=0.1898, 250=0.14024, 500=0.1089, 1000=0.0858 (USD); Tolerance: ±20%; Temperature Coefficient: X5R; Mounting Type: Surface Mount, MLCC; Applications: General Purpose; Ratings: -; Size / Dimension: 0.063" L x 0.031" W (1.60mm x 0.80mm); Height - Seated (Max): -; Thickness (Max): 0.037" (0.95mm); Lead Spacing: -; Packaging: Cut Tape (CT); Lead Style: -; ComponentLink1URL: http://www.tdk.com/pdf/general_B11.pdf; ComponentLink1Description: http://www.tdk.com/pdf/general_B11.pdf
C36 = GRM155R71H272KA01D: CAP CER 2700PF 50V 10% X7R 0402; Manufacturer: Murata Electronics North America; .Checked PCB: RF; Supplier 1: Digi-Key; Supplier Part Number 1: 490-1306-1-ND; Manufacturer Part Number: GRM155R71H272KA01D; RoHS: RoHS Compliant; Category: Capacitors; Stock 1: 38160; Pricing 1: 10=0.01, 50=0.0086, 100=0.0074, 250=0.00664, 500=0.00618, 750=0.00571, 1000=0.00542 (USD); Capacitance: 2700pF; Voltage - Rated: 50V; Tolerance: ±10%; Temperature Coefficient: X7R; Mounting Type: Surface Mount, MLCC; Operating Temperature: -55°C ~ 125°C; Applications: General Purpose; Ratings: -; Package / Case: 0402 (1005 Metric); Size / Dimension: 0.039" L x 0.020" W (1.00mm x 0.50mm); Height - Seated (Max): -; Thickness (Max): 0.022" (0.55mm); Lead Spacing: -; Features: -; Packaging: Cut Tape (CT); Lead Style: -; ComponentLink1URL: http://search.murata.co.jp/Ceramy/image/img/PDF/ENG/GRM155R71H272KA01.pdf; ComponentLink1Description: http://search.murata.co.jp/Ceramy/image/img/PDF/ENG/GRM155R71H272KA01.pdf; .Checked SCH: RF
C40 = T495D337K010ATE150: CAP TANT 330UF 10V 10% 2917; Manufacturer: Kemet; Manufacturer Size Code: D; Capacitance: 330µF; ESR (Equivalent Series Resistance): 150 mOhm; Type: Molded; .Creator: MM; .Checked SCH: RF, used by MM; Supplier 1: Digi-Key; Manufacturer Part Number: T495D337K010ATE150; RoHS: RoHS Compliant; Category: Capacitors; Stock 1: 272; Pricing 1: 1=1.84, 10=1.455, 50=1.2612, 100=1.0915, 250=0.9702 (USD); Packaging: Cut Tape (CT); Voltage - Rated: 10V; Tolerance: ±10%; Operating Temperature: -55°C ~ 125°C; Mounting Type: Surface Mount; Package / Case: 2917 (7343 Metric); Size / Dimension: 0.287" L x 0.169" W (7.30mm x 4.30mm); Height - Seated (Max): 0.122" (3.10mm); Lead Spacing: -; Features: General Purpose; Lifetime @ Temp.: -; ComponentLink1URL: http://www.kemet.com/kemet/web/homepage/kechome.nsf/vapubfiles/KEM_T2009_T495.pdf/$file/KEM_T2009_T495.pdf; ComponentLink1Description: http://www.kemet.com/kemet/web/homepage/kechome.nsf/vapubfiles/KEM_T2009_T495.pdf/$file/KEM_T2009_T495.pdf; Supplier Part Number 1: 399-10511-1-ND; .Checked PCB: MM
C47 C52 C55 C56 C67 = C1005X5R1C474K: CAP CER .47UF 16V X5R 0402; Manufacturer: TDK Corporation; Capacitance: 0.47µF; .Checked PCB: used; Description: CAP CER 0.47UF 16V 10% X5R 0402; Tolerance: ±10%; Category: Capacitors; Supplier Part Number: 445-4976-1-ND; Manufacturer Part Number: C1005X5R1C474K; Operating Temperature: -55°C ~ 85°C; Package / Case: 0402 (1005 Metric); Price 1k [$]: 0.02400; Value: 470nF; .Checked SCH: used; Voltage - Rated: 16V; Supplier: Digikey; Supplier 1: Digi-Key; Supplier Part Number 1: 445-4976-1-ND; RoHS: RoHS Compliant; Stock 1: 141502; Pricing 1: 1=0.24, 10=0.16, 100=0.064, 250=0.046, 500=0.0328, 1000=0.024 (USD); Temperature Coefficient: X5R; Mounting Type: Surface Mount, MLCC; Applications: General Purpose; Ratings: -; Size / Dimension: 0.039" L x 0.020" W (1.00mm x 0.50mm); Height - Seated (Max): -; Thickness (Max): 0.022" (0.55mm); Lead Spacing: -; Features: -; Packaging: Cut Tape (CT); Lead Style: -; ComponentLink1URL: http://www.tdk.co.jp/tefe02/e412_c.pdf; ComponentLink1Description: http://www.tdk.co.jp/tefe02/e412_c.pdf
C49 = C1005X7R1H103K: CAP CER 10000PF 50V 10% X7R 0402; Manufacturer: TDK Corporation; Value: 10nF; .Checked PCB: RF; Capacitance: 10000pF; Category: Capacitors; Supplier Part Number: 445-6850-1-ND; Manufacturer Part Number: C1005X7R1H103K; Operating Temperature: -55°C ~ 125°C; Package / Case: 0402 (1005 Metric); Price 1k [$]: 0.01625; .Checked SCH: RF; Voltage - Rated: 50V; Supplier: Digikey; Supplier 1: Digi-Key; Supplier Part Number 1: 445-6850-1-ND; RoHS: RoHS Compliant; Stock 1: 3901; Pricing 1: 1=0.2, 10=0.125, 100=0.045, 250=0.03252, 500=0.024, 1000=0.01625 (USD); Tolerance: ±10%; Temperature Coefficient: X7R; Mounting Type: Surface Mount, MLCC; Applications: General Purpose; Ratings: -; Size / Dimension: 0.039" L x 0.020" W (1.00mm x 0.50mm); Height - Seated (Max): -; Thickness (Max): 0.022" (0.55mm); Lead Spacing: -; Features: -; Packaging: Cut Tape (CT); Lead Style: -; ComponentLink1URL: http://www.tdk.co.jp/tefe02/e412_c.pdf; ComponentLink1Description: http://www.tdk.co.jp/tefe02/e412_c.pdf
C54 = GRM155R71H271KA01D: CAP CER 270PF 50V 10% X7R 0402; Manufacturer: Murata Electronics North America; .Checked PCB: RF; Supplier 1: Digi-Key; Supplier Part Number 1: 490-1299-1-ND; Manufacturer Part Number: GRM155R71H271KA01D; RoHS: RoHS Compliant; Category: Capacitors; Stock 1: 83894; Pricing 1: 10=0.032, 50=0.0252, 100=0.0189, 250=0.01364, 500=0.01008, 1000=0.00683, 5000=0.00525 (USD); Capacitance: 270pF; Voltage - Rated: 50V; Tolerance: ±10%; Temperature Coefficient: X7R; Mounting Type: Surface Mount, MLCC; Operating Temperature: -55°C ~ 125°C; Applications: General Purpose; Ratings: -; Package / Case: 0402 (1005 Metric); Size / Dimension: 0.039" L x 0.020" W (1.00mm x 0.50mm); Height - Seated (Max): -; Thickness (Max): 0.022" (0.55mm); Lead Spacing: -; Features: -; Packaging: Cut Tape (CT); Lead Style: -; ComponentLink1URL: http://search.murata.co.jp/Ceramy/image/img/PDF/ENG/GRM155R71H271KA01.pdf; ComponentLink1Description: http://search.murata.co.jp/Ceramy/image/img/PDF/ENG/GRM155R71H271KA01.pdf; .Checked SCH: RF
C62 = C1005X5R1A225K: CAP CER 2.2UF 10V 10% X5R 0402; Manufacturer: TDK Corporation; Capacitance: 2.2µF; .Checked PCB: RF; Supplier 1: Digi-Key; Supplier Part Number 1: 445-7392-1-ND; Manufacturer Part Number: C1005X5R1A225K; RoHS: RoHS Compliant; Category: Capacitors; Stock 1: 22891; Pricing 1: 1=0.42, 10=0.332, 100=0.2, 250=0.15, 500=0.128, 1000=0.1 (USD); Voltage - Rated: 10V; Tolerance: ±10%; Temperature Coefficient: X5R; Mounting Type: Surface Mount, MLCC; Operating Temperature: -55°C ~ 85°C; Applications: General Purpose; Ratings: -; Package / Case: 0402 (1005 Metric); Size / Dimension: 0.039" L x 0.020" W (1.00mm x 0.50mm); Height - Seated (Max): -; Thickness (Max): 0.022" (0.55mm); Lead Spacing: -; Features: -; Packaging: Cut Tape (CT); Lead Style: -; ComponentLink1URL: http://www.tdk.com/pdf/general_B11.pdf; ComponentLink1Description: http://www.tdk.com/pdf/general_B11.pdf; .Checked SCH: RF
CR2 = Card_Mini_PCIe: Card MIni PCIe; .Creator: MM; Category: Card
D5 = BZA956A,115: TVS ZENER QUAD 5.6V SOT665; Manufacturer: NXP Semiconductors; Voltage - Reverse Standoff (Typ): 3V; Voltage - Breakdown: 5.32V; Power (Watts): 16W; Polarization: 4 Channel Array - Unidirectional; .Creator: MM; Supplier 1: Digi-Key; Manufacturer Part Number: BZA956A,115; RoHS: RoHS Compliant; Category: Circuit Protection; Stock 1: 7740; Pricing 1: 1=0.55, 10=0.386, 25=0.3176, 100=0.2537, 250=0.1848, 500=0.15008, 1000=0.11536 (USD); Packaging: Cut Tape (CT); Mounting Type: Surface Mount; Package / Case: SOT-665; Supplier Device Package: SOT-665; ComponentLink1URL: http://www.nxp.com/documents/data_sheet/BZA900A_SERIES.pdf; ComponentLink1Description: http://www.nxp.com/documents/data_sheet/BZA900A_SERIES.pdf; Supplier Part Number 1: 568-7016-1-ND; .Checked PCB: MM; .Checked SCH: MM
D6 = LG L29K-G2J1-24-Z: LED SMARTLED GREEN 570NM 0603; Manufacturer: OSRAM Opto Semiconductors Inc; .Checked PCB: used; Current - Test: 2mA; Voltage - Forward (Vf) Typ: 1.7V; Luminous Flux @ Current - Test: 12 mlm; Millicandela Rating: 3.92mcd; Wavelength - Peak: 572nm; Lens Type: Diffused; Lens Style/Size: Rectangle with Flat Top, 1.3mm x 0.8mm; Viewing Angle: 160°; Regulator Topology: Positive Fixed; Voltage - Output: 2.5V; Voltage - Input: 2.6 V ~ 6 V; Voltage - Dropout (Typical): 0.16V @ 500mA; Number of Regulators: 1; Current - Output: 500mA; Current - Limit (Min): 600mA; .Checked SCH: used; Category: Optoelectronics; Supplier Part Number: 475-2709-1-ND; Family: LEDs - <75mA, Discre; Manufacturer Part Number: LG L29K-G2J1-24-Z; Price 1k [$]: 0.08744; Value: Green; Color: Green; Package / Case: 0603 (1608 Metric); Supplier: Digikey; Supplier 1: Digi-Key; Supplier Part Number 1: 475-2709-1-ND; RoHS: RoHS Compliant; Stock 1: 30318; Pricing 1: 1=0.16, 10=0.137, 100=0.1093, 250=0.09564, 500=0.08744 (USD); Wavelength - Dominant: 570nm; Size / Dimension: 1.70mm L x 0.80mm W; Height: 0.65mm; Mounting Type: Surface Mount; Packaging: Cut Tape (CT); ComponentLink1URL: http://catalog.osram-os.com/catalogue/catalogue.do;jsessionid=32CB61882C089EDD4B6D0A54E7E1F117?act=downloadFile&favOid=020000020000138e000100b6; ComponentLink1Description: http://catalog.osram-os.com/catalogue/catalogue.do;jsessionid=32CB61882C089EDD4B6D0A54E7E1F117?act=downloadFile&favOid=020000020000138e000100b6; Operating Temperature: -40°C ~ 125°C; Supplier Device Package: 6-TMLF® (1.6x1.6); ComponentLink2URL: http://www.micrel.com/_PDF/mic5353.pdf; ComponentLink2Description: http://www.micrel.com/_PDF/mic5353.pdf
FB2-FB4 = BLM18SG221TN1D: FERRITE CHIP 220 OHM 2500MA 0603; Manufacturer: Murata Electronics North America; Impedance @ Frequency: 220 Ohm @ 100MHz; DC Resistance (DCR): 40 mOhm Max; Filter Type: Differential Mode - Single; Number of Lines: 1; .Checked PCB: RF; Supplier 1: Digi-Key; Supplier Part Number 1: 490-5225-1-ND; Manufacturer Part Number: BLM18SG221TN1D; RoHS: RoHS Compliant; Category: Filters; Stock 1: 54640; Pricing 1: 1=0.38, 10=0.282, 50=0.1646, 100=0.1316, 250=0.094, 500=0.06392, 1000=0.0517, 5000=0.04042 (USD); Current Rating: 2.5A; Package / Case: 0603 (1608 Metric); Mounting Type: Surface Mount; Packaging: Cut Tape (CT); Height (Max): 0.037" (0.95mm); Size / Dimension: 0.063" L x 0.031" W (1.60mm x 0.80mm); ComponentLink1URL: http://search.murata.co.jp/Ceramy/image/img/PDF/ENG/L0110S0100BLM18S.pdf; ComponentLink1Description: http://search.murata.co.jp/Ceramy/image/img/PDF/ENG/L0110S0100BLM18S.pdf; .Checked SCH: RF
FB5 FB24 = BLM15AX601SN1D: FERRITE CHIP 600 OHM 0402 420mA; Manufacturer: Murata Electronics North America; .Checked PCB: used; Impedance @ Frequency: 600 Ohm @ 100MHz; DC Resistance (DCR): 340 mOhm Max; Filter Type: Differential Mode - Single; Number of Lines: 1; .Checked SCH: used; Category: Filters; Supplier Part Number: 490-5441-1-ND; Manufacturer Part Number: BLM15AX601SN1D; Package / Case: 0402 (1005 Metric); Price 1k [$]: 0.03280; Value: BLM15AX601SN1D; Current Rating: 420mA; Supplier: Digikey; Supplier 1: Digi-Key; Supplier Part Number 1: 490-5441-1-ND; RoHS: RoHS Compliant; Description: FERRITE CHIP 600 OHM 0402; Stock 1: 34008; Pricing 1: 1=0.26, 10=0.197, 50=0.1148, 100=0.0918, 250=0.0656, 500=0.0446, 1000=0.03608, 5000=0.02821 (USD); Mounting Type: Surface Mount; Packaging: Cut Tape (CT); Height (Max): 0.022" (0.55mm); Size / Dimension: 0.039" L x 0.020" W (1.00mm x 0.50mm); ComponentLink1URL: http://search.murata.co.jp/Ceramy/image/img/PDF/ENG/L0110S0100BLM15AX_SN.pdf; ComponentLink1Description: http://search.murata.co.jp/Ceramy/image/img/PDF/ENG/L0110S0100BLM15AX_SN.pdf
FB19 FB23 FB25 = MPZ1608S601A: FERRITE CHIP BEAD 600 OHM SMD 1A; Manufacturer: TDK Corporation; Impedance @ Frequency: 600 Ohm @ 100MHz; DC Resistance (DCR): 150 mOhm Max; Filter Type: Differential Mode - Single; Number of Lines: 1; .Checked PCB: RF; Supplier 1: Digi-Key; Supplier Part Number 1: 445-2205-1-ND; Manufacturer Part Number: MPZ1608S601A; RoHS: RoHS Compliant; Description: FERRITE CHIP BEAD 600 OHM SMD; Category: Filters; Stock 1: 328345; Pricing 1: 1=0.36, 10=0.24, 100=0.096, 250=0.069, 500=0.0492, 1000=0.036 (USD); Current Rating: 1A; Package / Case: 0603 (1608 Metric); Mounting Type: Surface Mount; Packaging: Cut Tape (CT); Height (Max): 0.037" (0.95mm); Size / Dimension: 0.063" L x 0.031" W (1.60mm x 0.80mm); ComponentLink1URL: http://www.tdk.co.jp/tefe02/e9413_mpz.pdf; ComponentLink1Description: http://www.tdk.co.jp/tefe02/e9413_mpz.pdf; .Checked SCH: RF
J7 = 0475531001: CONN CARD HOLDER SIM 6POS SMD; Manufacturer: Molex Inc; Card Type: SIM Card; Number of Positions: 8 (6 + 2); Connector Type: Connector; Insertion, Removal Method: Push In, Push Out; .Creator: MM; Supplier 1: Digi-Key; Manufacturer Part Number: 0475531001; RoHS: RoHS Compliant; Category: Connectors, Interconnects; Stock 1: 8474; Pricing 1: 1=2.94, 10=2.822, 25=2.5868, 50=2.4694, 100=2.3518, 250=2.05784 (USD); Packaging: Cut Tape (CT); Ejector Side: -; Mounting Type: Surface Mount, Right Angle; Features: Switch; Height Above Board: 0.071" (1.80mm); Mounting Feature: Normal, Standard - Top; Contact Finish: Gold; Contact Finish Thickness: 30µin (0.76µm); ComponentLink1URL: http://www.molex.com/pdm_docs/sd/475531001_sd.pdf; ComponentLink1Description: http://www.molex.com/pdm_docs/sd/475531001_sd.pdf; Supplier Part Number 1: WM6739CT-ND; .Checked PCB: MM; .Checked SCH: MM
J8 = MM60-EZH059-B5-R650: CONN MINI EXPRESS CARD LATCH SMD; Manufacturer: JAE Electronics; For Use With/Related Products: PCI Express Mini Card; .Creator: MM; Supplier 1: Digi-Key; Manufacturer Part Number: MM60-EZH059-B5-R650; RoHS: RoHS Compliant; Category: Connectors, Interconnects; Stock 1: 4853; Pricing 1: 1=1.22, 10=1.075, 25=1.0116, 100=0.9272, 250=0.84292 (USD); Packaging: Cut Tape (CT); Accessory Type: Latch; ComponentLink1URL: http://jae-connector.com/en/pdf/SJ105221.pdf; ComponentLink1Description: http://jae-connector.com/en/pdf/SJ105221.pdf; Supplier Part Number 1: 670-2277-1-ND; .Checked PCB: MM; .Checked SCH: MM
J9 = MM60-52B1-E1-R650: CONN MINI EXPRESS CARD 52POS SMD; Manufacturer: JAE Electronics; Card Type: PCI Express Mini Card; Gender: Female; Number of Positions: 52; Card Thickness: 0.039" (1.00mm); Pitch: 0.031" (0.80mm); Material - Insulation: Thermoplastic; Read Out: Dual; .Creator: MM; Supplier 1: Digi-Key; Manufacturer Part Number: MM60-52B1-E1-R650; RoHS: RoHS Compliant; Category: Connectors, Interconnects; Stock 1: 470; Pricing 1: 1=2.16, 10=1.962, 25=1.842, 100=1.6817, 250=1.52152 (USD); Packaging: Cut Tape (CT); Number of Positions/Bay/Row: -; Number of Rows: 2; Features: Board Guide; Mounting Type: Surface Mount, Right Angle; Termination: Solder; Contact Material: Copper Alloy; Contact Finish: Gold; Contact Finish Thickness: 4µin (0.10µm); Contact Type: -; Color: -; Flange Feature: -; Operating Temperature: -40°C ~ 85°C; ComponentLink1URL: http://jae-connectors.com/en/pdf/JACS-10313_MM60.pdf; ComponentLink1Description: http://jae-connectors.com/en/pdf/JACS-10313_MM60.pdf; Supplier Part Number 1: 670-2275-1-ND; .Checked PCB: MM; .Checked SCH: MM
J10-J12 = 76384-302LF: CONN HEADER 2POS .100" STR GOLD; Manufacturer: FCI; Connector Type: Header, Shrouded; Number of Positions: 2; Number of Positions Loaded: All; Pitch: 0.100" (2.54mm); .Creator: MM; Supplier 1: Digi-Key; Manufacturer Part Number: 76384-302LF; RoHS: RoHS Compliant; Category: Connectors, Interconnects; Stock 1: 3152; Pricing 1: 1=0.47, 10=0.442, 25=0.3976, 50=0.3532, 100=0.3386, 250=0.30912, 500=0.2944, 1000=0.24288, 2500=0.2208 (USD); Packaging: Tube; Contact Type: Male Pin; Number of Rows: 1; Row Spacing: -; Contact Mating Length: 0.197" (5.00mm); Mounting Type: Through Hole; Termination: Solder; Fastening Type: Friction Lock; Features: -; Contact Finish: Gold, GXT™; Contact Finish Thickness: 30µin (0.76µm); Color: Black; ComponentLink1URL: http://portal.fciconnect.com/Comergent//fci/drawing/76384.pdf; ComponentLink1Description: http://portal.fciconnect.com/Comergent//fci/drawing/76384.pdf; Supplier Part Number 1: 609-1304-ND; .Checked PCB: MM; .Checked SCH: MM
J13 = 76384-303LF: CONN HEADER 3POS .100" STR GOLD; Manufacturer: FCI; Connector Type: Header, Shrouded; Number of Positions: 3; Number of Positions Loaded: All; Pitch: 0.100" (2.54mm); .Creator: MM; Supplier 1: Digi-Key; Manufacturer Part Number: 76384-303LF; RoHS: RoHS Compliant; Category: Connectors, Interconnects; Stock 1: 1441; Pricing 1: 1=0.59, 10=0.556, 25=0.5, 50=0.4444, 100=0.426, 250=0.38892, 500=0.3704, 1000=0.30558, 2500=0.2778 (USD); Packaging: Tube; Contact Type: Male Pin; Number of Rows: 1; Row Spacing: -; Contact Mating Length: 0.197" (5.00mm); Mounting Type: Through Hole; Termination: Solder; Fastening Type: Friction Lock; Features: -; Contact Finish: Gold, GXT™; Contact Finish Thickness: 30µin (0.76µm); Color: Black; ComponentLink1URL: http://portal.fciconnect.com/Comergent//fci/drawing/76384.pdf; ComponentLink1Description: http://portal.fciconnect.com/Comergent//fci/drawing/76384.pdf; Supplier Part Number 1: 609-1305-ND; .Checked PCB: MM; .Checked SCH: MM
L2 = ACM2012-900-2P-T002: CHOKE COMM MODE 90 OHM .4A SMD; Manufacturer: TDK Corporation; Filter Type: Data, Signal Line; Number of Lines: 2; Current: 400mA; DC Resistance (DCR): 190 mOhm Max; Impedance: 90 Ohm; Resistance (Ohms): 8.2K; Power (Watts): 0.063W, 1/16W; Temperature Coefficient: ±100ppm/°C; Tolerance: ±1%; .Checked PCB: RF; Supplier 1: Digi-Key; Supplier Part Number 1: 445-2207-1-ND; Manufacturer Part Number: ACM2012-900-2P-T002; RoHS: RoHS Compliant; Category: Filters; Stock 1: 175768; Pricing 1: 1=0.48, 10=0.448, 50=0.42, 100=0.364, 500=0.308, 1000=0.252 (USD); Inductance: -; Mounting Type: Surface Mount; Size / Dimension: 0.079" L x 0.047" W (2.00mm x 1.20mm); Height (Max): 0.051" (1.30mm); Package / Case: 0805 (2012 Metric), 4 Lead; Operating Temperature: -25°C ~ 85°C; Packaging: Cut Tape (CT); ComponentLink1URL: http://www.tdk.co.jp/tefe02/e9719_acm2012.pdf; ComponentLink1Description: http://www.tdk.co.jp/tefe02/e9719_acm2012.pdf; Composition: Thick Film; Features: -; Height: 0.016" (0.40mm); Number of Terminations: 2; ComponentLink2URL: http://www.yageo.com/documents/recent/PYu-RC0402_51_RoHS_L_6.pdf; ComponentLink2Description: http://www.yageo.com/documents/recent/PYu-RC0402_51_RoHS_L_6.pdf; .Checked SCH: RF
R17 = RC0402FR-07200KL: RES 200K OHM 1/16W 1% 0402 SMD; Manufacturer: Yageo; Power (Watts): 0.063W, 1/16W; .Checked PCB: used; Temperature Coefficient: ±100ppm/°C; Category: Resistors; Supplier Part Number: 311-200KLRCT-ND; Manufacturer Part Number: RC0402FR-07200KL; Package / Case: 0402 (1005 Metric); Price 1k [$]: 0.01421; Resistance (Ohms): 200K; Tolerance: ±1%; Value: 200k; .Checked SCH: used; Supplier: Digikey; Supplier 1: Digi-Key; Supplier Part Number 1: 311-200KLRCT-ND; RoHS: RoHS Compliant; Stock 1: 225869; Pricing 1: 10=0.014, 50=0.0104, 100=0.0079, 250=0.00584, 500=0.00432, 1000=0.00288 (USD); Composition: Thick Film; Features: -; Size / Dimension: 0.039" L x 0.020" W (1.00mm x 0.50mm); Height: 0.016" (0.40mm); Number of Terminations: 2; Packaging: Cut Tape (CT); ComponentLink1URL: http://www.yageo.com/documents/recent/PYu-RC0402_51_RoHS_L_6.pdf; ComponentLink1Description: http://www.yageo.com/documents/recent/PYu-RC0402_51_RoHS_L_6.pdf
R25 = CRCW0402330RFKED: RES 330 OHM 1/16W 1% 0402 SMD; Manufacturer: Vishay Dale; Resistance (Ohms): 330; Power (Watts): 0.063W, 1/16W; Temperature Coefficient: ±100ppm/°C; .Checked PCB: RF; Supplier 1: Digi-Key; Supplier Part Number 1: 541-330LCT-ND; Manufacturer Part Number: CRCW0402330RFKED; RoHS: RoHS Compliant; Category: Resistors; Stock 1: 49303; Pricing 1: 10=0.083, 50=0.0444, 200=0.0255, 1000=0.0174 (USD); Composition: Thick Film; Features: -; Tolerance: ±1%; Package / Case: 0402 (1005 Metric); Size / Dimension: 0.039" L x 0.020" W (1.00mm x 0.50mm); Height: 0.016" (0.40mm); Number of Terminations: 2; Packaging: Cut Tape (CT); ComponentLink1URL: http://www.vishay.com/doc?20035; ComponentLink1Description: http://www.vishay.com/doc?20035; .Checked SCH: RF
R26 = RC0402FR-073KL: RES 3K OHM 1/16W 1% 0402 SMD; Manufacturer: Yageo; Power (Watts): 0.063W, 1/16W; Temperature Coefficient: ±100ppm/°C; .Creator: MM; .Checked SCH: RF, used by MM; Supplier 1: Digi-Key; Manufacturer Part Number: RC0402FR-073KL; RoHS: RoHS Compliant; Category: Resistors; Stock 1: 194271; Pricing 1: 1=0.1, 10=0.014, 25=0.0104, 100=0.0063, 250=0.0054, 500=0.00382, 1000=0.0027, 2500=0.00234, 5000=0.00203 (USD); Packaging: Cut Tape (CT); Resistance (Ohms): 3k; Tolerance: ±1%; Composition: Thick Film; Features: -; Package / Case: 0402 (1005 Metric); Supplier Device Package: 0402; Size / Dimension: 0.039" L x 0.020" W (1.00mm x 0.50mm); Height: 0.016" (0.40mm); Number of Terminations: 2; ComponentLink1URL: http://www.yageo.com/documents/recent/PYu-RC0402_51_RoHS_L_6.pdf; ComponentLink1Description: http://www.yageo.com/documents/recent/PYu-RC0402_51_RoHS_L_6.pdf; Supplier Part Number 1: 311-3KLRCT-ND; .Checked PCB: RF, used by MM
R27 = CRCW04022K40FKED: RES 2.40K OHM 1/16W 1% 0402 SMD; Manufacturer: Vishay Dale; Resistance (Ohms): 2.4K; Power (Watts): 0.063W, 1/16W; Temperature Coefficient: ±100ppm/°C; .Checked PCB: RF; Supplier 1: Digi-Key; Supplier Part Number 1: 541-2.40KLCT-ND; Manufacturer Part Number: CRCW04022K40FKED; RoHS: RoHS Compliant; Category: Resistors; Stock 1: 43967; Pricing 1: 10=0.083, 50=0.0444, 200=0.0255, 1000=0.0174 (USD); Composition: Thick Film; Features: -; Tolerance: ±1%; Package / Case: 0402 (1005 Metric); Size / Dimension: 0.039" L x 0.020" W (1.00mm x 0.50mm); Height: 0.016" (0.40mm); Number of Terminations: 2; Packaging: Cut Tape (CT); ComponentLink1URL: http://www.vishay.com/doc?20035; ComponentLink1Description: http://www.vishay.com/doc?20035; .Checked SCH: RF
R28-R30 = RC0402FR-072K2L: RES 2.20K OHM 1/16W 1% 0402 SMD; Manufacturer: Yageo; Resistance (Ohms): 2.2K; Power (Watts): 0.063W, 1/16W; .Checked PCB: used; Temperature Coefficient: ±100ppm/°C; Category: Resistors; Supplier Part Number: 311-2.20KLRCT-ND; Manufacturer Part Number: RC0402FR-072K2L; Package / Case: 0402 (1005 Metric); Price 1k [$]: 0.01421; Tolerance: ±1%; Value: 2k2; .Checked SCH: used; Supplier: Digikey; Supplier 1: Digi-Key; Supplier Part Number 1: 311-2.20KLRCT-ND; RoHS: RoHS Compliant; Stock 1: 195154; Pricing 1: 10=0.014, 50=0.0104, 100=0.0079, 250=0.00584, 500=0.00432, 1000=0.00288 (USD); Composition: Thick Film; Features: -; Size / Dimension: 0.039" L x 0.020" W (1.00mm x 0.50mm); Height: 0.016" (0.40mm); Number of Terminations: 2; Packaging: Cut Tape (CT); ComponentLink1URL: http://www.yageo.com/documents/recent/PYu-RC0402_51_RoHS_L_6.pdf; ComponentLink1Description: http://www.yageo.com/documents/recent/PYu-RC0402_51_RoHS_L_6.pdf
R31 R33 R35 R116 R150 = RC0402FR-0710KL: RES 10.0K OHM 1/16W 1% 0402 SMD; Manufacturer: Yageo; Power (Watts): 0.063W, 1/16W; .Checked PCB: used; Temperature Coefficient: ±100ppm/°C; Category: Resistors; Supplier Part Number: 311-10.0KLRCT-ND; Manufacturer Part Number: RC0402FR-0710KL; Package / Case: 0402 (1005 Metric); Price 1k [$]: 0.01421; Resistance (Ohms): 10K; Tolerance: ±1%; Value: 10k; .Checked SCH: used; Supplier: Digikey; Supplier 1: Digi-Key; Supplier Part Number 1: 311-10.0KLRCT-ND; RoHS: RoHS Compliant; Stock 1: 2916495; Pricing 1: 10=0.014, 50=0.0104, 100=0.0079, 250=0.00584, 500=0.00432, 1000=0.00288 (USD); Composition: Thick Film; Features: -; Size / Dimension: 0.039" L x 0.020" W (1.00mm x 0.50mm); Height: 0.016" (0.40mm); Number of Terminations: 2; Packaging: Cut Tape (CT); ComponentLink1URL: http://www.yageo.com/documents/recent/PYu-RC0402_51_RoHS_L_6.pdf; ComponentLink1Description: http://www.yageo.com/documents/recent/PYu-RC0402_51_RoHS_L_6.pdf
R32 R34 R155 R156 = RC0402JR-070RL: RES 0.0 OHM 1/16W 0402 SMD; Manufacturer: Yageo; Resistance (Ohms): 0.0; Power (Watts): 0.063W, 1/16W; Tolerance: Jumper; .Checked PCB: used; Category: Resistors; Supplier Part Number: 311-0.0JRCT-ND; Manufacturer Part Number: RC0402JR-070RL; Package / Case: 0402 (1005 Metric); Price 1k [$]: 0.01389; Value: 0R; .Checked SCH: used; Supplier: Digikey; Supplier 1: Digi-Key; Supplier Part Number 1: 311-0.0JRCT-ND; RoHS: RoHS Compliant; Stock 1: 1106330; Pricing 1: 10=0.012, 50=0.009, 100=0.0069, 250=0.00512, 500=0.0038, 1000=0.00253 (USD); Composition: Thick Film; Features: -; Temperature Coefficient: -; Size / Dimension: 0.039" L x 0.020" W (1.00mm x 0.50mm); Height: 0.016" (0.40mm); Number of Terminations: 2; Packaging: Cut Tape (CT); ComponentLink1URL: http://www.yageo.com/documents/recent/PYu-RC0402_51_RoHS_L_6.pdf; ComponentLink1Description: http://www.yageo.com/documents/recent/PYu-RC0402_51_RoHS_L_6.pdf
TP4 TP5 = TP_25MILC: Test Point 25mil
U3 = TPS74801DRCR: IC REG LDO ADJ 1.5A 10SON; Manufacturer: Texas Instruments; Number of Regulators: 1; Regulator Topology: Positive Adjustable; Voltage - Input: 0.8 V ~ 5.5 V; Voltage - Output: 0.8 V ~ 3.6 V; Voltage - Dropout (Typical): 0.06V @ 1.5A; Current - Output: 1.5A (Max); Current - Limit (Min): 2A; .Creator: MM; .Checked PCB: RF, used by MM; Supplier 1: Digi-Key; Manufacturer Part Number: TPS74801DRCR; RoHS: RoHS Compliant; Category: Integrated Circuits (ICs); Stock 1: 11680; Pricing 1: 1=2.3, 10=2.074, 25=1.8576, 100=0.972, 250=0.954, 500=0.936, 750=0.918 (USD); Packaging: Cut Tape (CT); Operating Temperature: -40°C ~ 125°C; Mounting Type: Surface Mount; Package / Case: 10-VFDFN Exposed Pad; Supplier Device Package: 10-SON (3x3); ComponentLink1URL: http://www.ti.com/lit/ds/symlink/tps74801.pdf; ComponentLink1Description: http://www.ti.com/lit/ds/symlink/tps74801.pdf; Supplier Part Number 1: 296-21563-1-ND; .Checked SCH: MM
U4 = TPA6041A4RHBR: IC AMP AUDIO PWR 2.6W AB 32VQFN; Manufacturer: Texas Instruments; Output Type: 2-Channel (Stereo) with Stereo Headphones; Max Output Power x Channels @ Load: 2.6W x 2 @ 4 Ohm; 200mW x 2 @ 16 Ohm; Voltage - Supply: 4.5 V ~ 5.5 V; .Creator: MM; Supplier 1: Digi-Key; Manufacturer Part Number: TPA6041A4RHBR; RoHS: RoHS Compliant; Category: Integrated Circuits (ICs); Stock 1: 2838; Pricing 1: 1=3, 10=2.707, 25=2.4252, 100=2.1808, 250=1.9364, 500=1.692, 1000=1.4006 (USD); Packaging: Cut Tape (CT); Type: Class AB; Features: Differential Inputs, Short-Circuit and Thermal Protection, Shutdown; Mounting Type: Surface Mount; Supplier Device Package: 32-VQFN (5x5); Package / Case: 32-VFQFN Exposed Pad; ComponentLink1URL: http://www.ti.com/lit/ds/symlink/tpa6041a4.pdf; ComponentLink1Description: http://www.ti.com/lit/ds/symlink/tpa6041a4.pdf; Supplier Part Number 1: 296-22938-1-ND; .Checked PCB: MM; .Checked SCH: MM
U5 = MAX9867ETJ+: IC STEREO AUD CODEC LP 32TQFN-EP; Manufacturer: Maxim Integrated; Data Interface: I²C, Serial; Resolution (Bits): 18 b; Number of ADCs / DACs: 2 / 2; Sigma Delta: Yes; Dynamic Range, ADCs / DACs (db) Typ: 85 / 90; Voltage - Supply, Analog: 1.65 V ~ 1.95 V; .Creator: MM; .Checked PCB: RF, used by MM; Supplier 1: Digi-Key; Manufacturer Part Number: MAX9867ETJ+; RoHS: RoHS Compliant; Category: Integrated Circuits (ICs); Stock 1: 1716; Pricing 1: 1=2.97, 10=2.822, 25=1.98, 50=1.881, 100=1.43, 250=1.35852, 500=1.26226 (USD); Packaging: Tray; Type: Stereo Audio; S/N Ratio, ADCs / DACs (db) Typ: -; Voltage - Supply, Digital: 1.65 V ~ 1.95 V; Operating Temperature: -40°C ~ 85°C; Mounting Type: Surface Mount; Package / Case: 32-WFQFN Exposed Pad; Supplier Device Package: 32-TQFN-EP (5x5); ComponentLink1URL: http://datasheets.maximintegrated.com/en/ds/MAX9867.pdf; ComponentLink1Description: http://datasheets.maximintegrated.com/en/ds/MAX9867.pdf; Supplier Part Number 1: MAX9867ETJ+-ND; .Checked SCH: MM
U6 = PCA9306DCTR: IC VOLT-LEVEL TRANSLATOR SM8; Manufacturer: Texas Instruments; Logic Function: Translator, Bidirectional, Open Drain; Number of Bits: 2; Input Type: I2C/SMBus; Output Type: I²C™/SMBus™; Number of Outputs/Channel: 1; Differential - Input:Output: No/No; Propagation Delay (Max): 0.3ns; Voltage - Supply: 1.2 V ~ 3.3 V, 1.8 V ~ 5.5 V; .Creator: MM; Supplier 1: Digi-Key; Manufacturer Part Number: PCA9306DCTR; RoHS: RoHS Compliant; Category: Integrated Circuits (ICs); Stock 1: 21877; Pricing 1: 1=0.94, 10=0.829, 25=0.7488, 100=0.351, 250=0.34452, 500=0.338, 750=0.33151 (USD); Packaging: Cut Tape (CT); Data Rate: -; Number of Channels: 2; Operating Temperature: -40°C ~ 85°C; Package / Case: 8-LSSOP (0.11", 2.80mm Width); Supplier Device Package: SM8; Mounting Type: Surface Mount; ComponentLink1URL: http://www.ti.com/lit/ds/symlink/pca9306.pdf; ComponentLink1Description: http://www.ti.com/lit/ds/symlink/pca9306.pdf; Supplier Part Number 1: 296-18509-1-ND; .Checked PCB: MM; .Checked SCH: MM
Y1 = ASFLMB-12.288MHZ-LR-T: OSC MEMS 12.288 MHZ SMD; Manufacturer: Abracon Corporation; Function: Standby (Power Down); Output: CMOS; Voltage - Supply: 1.8 V ~ 3.3 V; Frequency Stability: ±25ppm; Current - Supply (Max): 16mA; Current - Supply (Disable) (Max): 15µA; .Creator: MM; Supplier 1: Digi-Key; Manufacturer Part Number: ASFLMB-12.288MHZ-LR-T; RoHS: RoHS Compliant; Category: Crystals and Oscillators; Stock 1: 5427; Pricing 1: 1=2.81, 10=2.438, 50=2.1376, 100=1.6875, 500=1.425 (USD); Packaging: Cut Tape (CT); Type: MEMS (Silicon); Frequency: 12.288MHz; Operating Temperature: -40°C ~ 85°C; Ratings: -; Mounting Type: Surface Mount; Size / Dimension: 0.197" L x 0.126" W (5.00mm x 3.20mm); Height: 0.035" (0.90mm); Package / Case: 4-SMD, No Lead (DFN, LCC); ComponentLink1URL: http://www.abracon.com/memspeedpro/MEMSpeedProFlyerII.pdf; ComponentLink1Description: http://www.abracon.com/memspeedpro/MEMSpeedProFlyerII.pdf; Supplier Part Number 1: 535-10982-1-ND; .Checked PCB: MM; .Checked SCH: MM